# EAGLE design FAT_main_board (EAGLE 6.1)
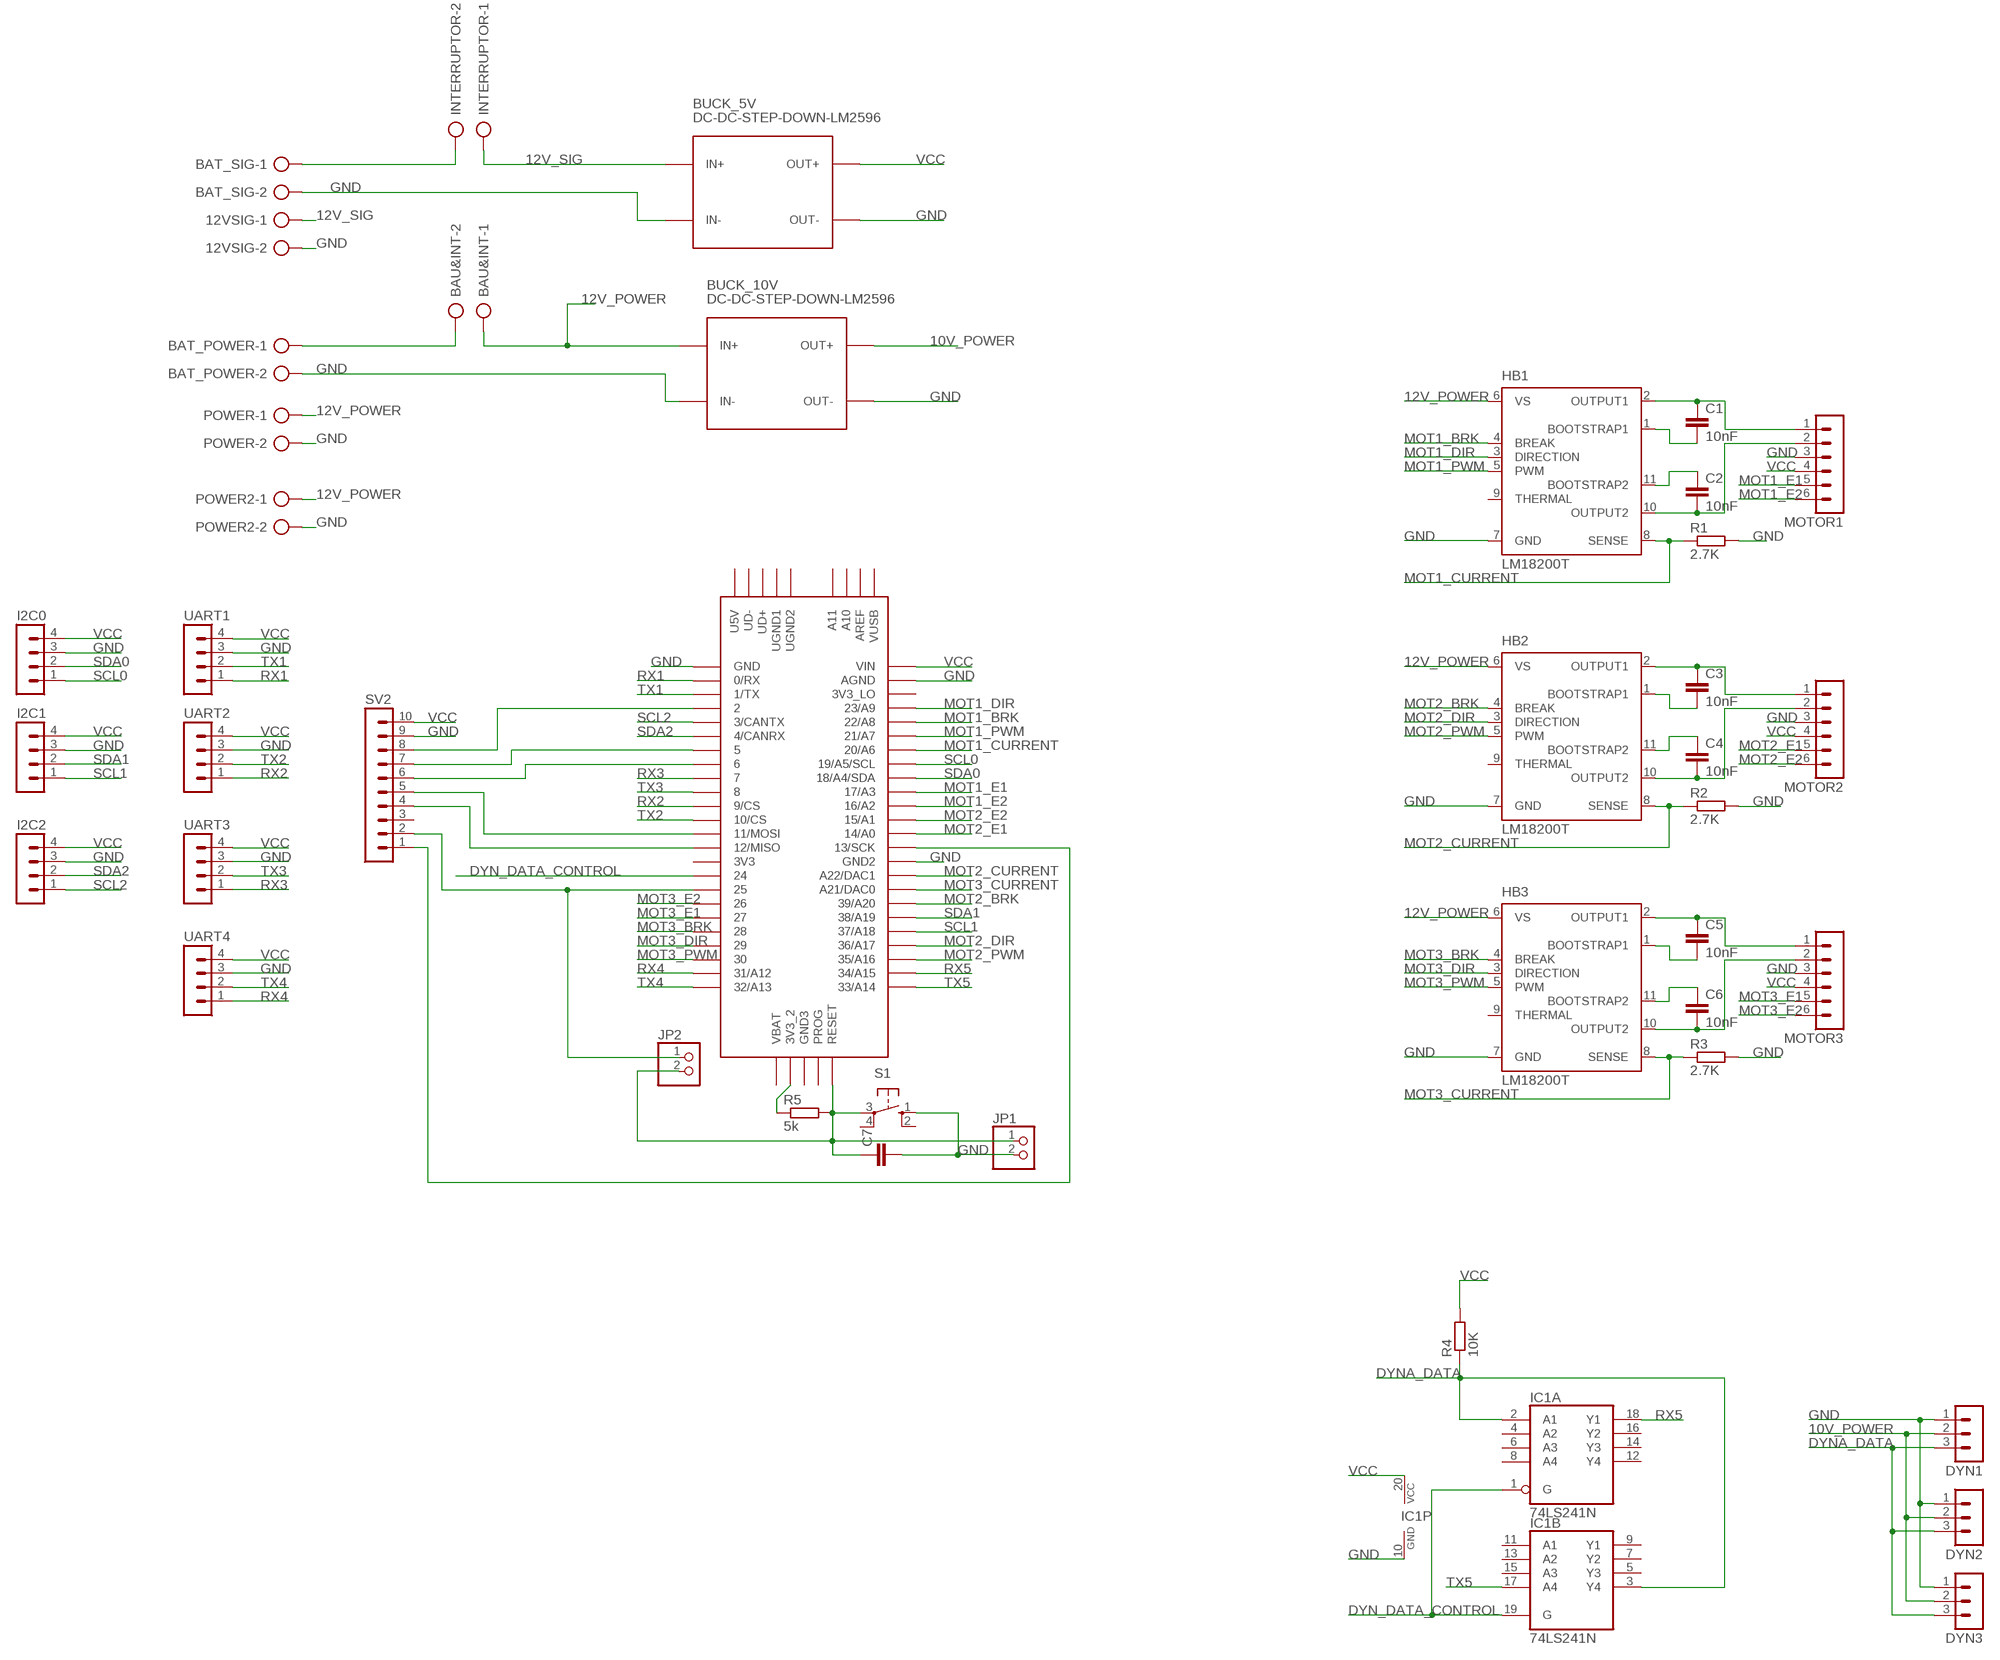
[diagram p0: schematic, sheet 1]

## Parts
12VSIG  AK300/2  [AK300/2]
BAT_POWER  AK300/2  [AK300/2]
BAT_SIG  AK300/2  [AK300/2]
BAU&INT  AK300/2  [AK300/2]
BUCK_5V  DC-DC-STEP-DOWN-LM2596  [DC-DC-STEP-DOWN-LM2596]
BUCK_10V  DC-DC-STEP-DOWN-LM2596  [DC-DC-STEP-DOWN-LM2596]
C1  10nF  C-EU050-035X075  [C050-035X075]
C2  10nF  C-EU050-035X075  [C050-035X075]
C3  10nF  C-EU050-035X075  [C050-035X075]
C4  10nF  C-EU050-035X075  [C050-035X075]
C5  10nF  C-EU050-035X075  [C050-035X075]
C6  10nF  C-EU050-035X075  [C050-035X075]
C7  C-EU025-025X050  [C025-025X050]
DYN1  MA03-1  [MA03-1]
DYN2  MA03-1  [MA03-1]
DYN3  MA03-1  [MA03-1]
HB1  LM18200T  [TO-220-11]
HB2  LM18200T  [TO-220-11]
HB3  LM18200T  [TO-220-11]
I2C0  MA04-1  [MA04-1]
I2C1  MA04-1  [MA04-1]
I2C2  MA04-1  [MA04-1]
IC1  74LS241N  [DIL20]
INTERRUPTOR  AK300/2  [AK300/2]
JP1  PINHD-1X2  [1X02]
JP2  PINHD-1X2  [1X02]
MOTOR1  MA06-1  [MA06-1]
MOTOR2  MA06-1  [MA06-1]
MOTOR3  MA06-1  [MA06-1]
POWER  AK300/2  [AK300/2]
POWER2  AK300/2  [AK300/2]
R1  2.7K  R-EU_0204/7  [0204/7]
R2  2.7K  R-EU_0204/7  [0204/7]
R3  2.7K  R-EU_0204/7  [0204/7]
R4  10K  R-EU_0204/7  [0204/7]
R5  5k  R-EU_0204/7  [0204/7]
S1  10-XX  [B3F-10XX]
SV2  MA10-1  [MA10-1]
U$1  TEENSY_3.5/3.6  [TEENSY_3.5/3.6]
UART1  MA04-1  [MA04-1]
UART2  MA04-1  [MA04-1]
UART3  MA04-1  [MA04-1]
UART4  MA04-1  [MA04-1]

## Nets
10V_POWER: BUCK_10V.OUT+ DYN1.2 DYN2.2 DYN3.2
12V_POWER: BAU&INT.1 BUCK_10V.IN+ HB1.6(VS) HB2.6(VS) HB3.6(VS) POWER2.1 POWER.1
12V_SIG: 12VSIG.1 BUCK_5V.IN+ INTERRUPTOR.1
DYN_DATA_CONTROL: IC1.1(A:G) IC1.19(B:G) U$1.24
DYNA_DATA: DYN1.3 DYN2.3 DYN3.3 IC1.2(A:A1) IC1.3(B:Y4) R4.1
GND: 12VSIG.2 BAT_POWER.2 BAT_SIG.2 BUCK_5V.IN- BUCK_5V.OUT- BUCK_10V.IN- BUCK_10V.OUT- C7.2 DYN1.1 DYN2.1 DYN3.1 HB1.7(GND) HB2.7(GND) HB3.7(GND) I2C0.3 I2C1.3 I2C2.3 IC1.10(P:GND) JP1.2 MOTOR1.3 MOTOR2.3 MOTOR3.3 POWER2.2 POWER.2 R1.2 R2.2 R3.2 S1.1(S) SV2.9 U$1.AGND U$1.GND U$1.GND2 UART1.3 UART2.3 UART3.3 UART4.3
MOT1_BRK: HB1.4(BREAK) U$1.22/A8
MOT1_CURRENT: HB1.8(SENSE) R1.1 U$1.20/A6
MOT1_DIR: HB1.3(DIRECTION) U$1.23/A9
MOT1_E1: MOTOR1.5 U$1.17/A3
MOT1_E2: MOTOR1.6 U$1.16/A2
MOT1_PWM: HB1.5(PWM) U$1.21/A7
MOT2_BRK: HB2.4(BREAK) U$1.39/A20
MOT2_CURRENT: HB2.8(SENSE) R2.1 U$1.A22/DAC1
MOT2_DIR: HB2.3(DIRECTION) U$1.36/A17
MOT2_E1: MOTOR2.5 U$1.14/A0
MOT2_E2: MOTOR2.6 U$1.15/A1
MOT2_PWM: HB2.5(PWM) U$1.35/A16
MOT3_BRK: HB3.4(BREAK) U$1.28
MOT3_CURRENT: HB3.8(SENSE) R3.1 U$1.21/DAC0(A21/DAC0)
MOT3_DIR: HB3.3(DIRECTION) U$1.29
MOT3_E1: MOTOR3.5 U$1.27
MOT3_E2: MOTOR3.6 U$1.26
MOT3_PWM: HB3.5(PWM) U$1.30
N$1: C1.1 HB1.2(OUTPUT1) MOTOR1.1
N$2: C2.2 HB1.10(OUTPUT2) MOTOR1.2
N$3: C1.2 HB1.1(BOOTSTRAP1)
N$4: C2.1 HB1.11(BOOTSTRAP2)
N$5: C3.1 HB2.2(OUTPUT1) MOTOR2.1
N$6: C3.2 HB2.1(BOOTSTRAP1)
N$7: C4.1 HB2.11(BOOTSTRAP2)
N$8: C4.2 HB2.10(OUTPUT2) MOTOR2.2
N$9: SV2.7 U$1.5
N$10: SV2.6 U$1.6
N$11: SV2.5 U$1.11/MOSI
N$12: SV2.4 U$1.12/MISO
N$13: BAT_POWER.1 BAU&INT.2
N$14: C5.1 HB3.2(OUTPUT1) MOTOR3.1
N$15: C5.2 HB3.1(BOOTSTRAP1)
N$16: C6.1 HB3.11(BOOTSTRAP2)
N$17: C6.2 HB3.10(OUTPUT2) MOTOR3.2
N$18: SV2.8 U$1.2
N$19: C7.1 JP1.1 JP2.2 R5.2 S1.3(P) U$1.RESET
N$20: BAT_SIG.1 INTERRUPTOR.2
N$24: SV2.1 U$1.13/SCK
N$26: R5.1 U$1.3V3_2
N$40: JP2.1 SV2.2 U$1.25
RX1: U$1.0/RX UART1.1
RX2: U$1.9/CS UART2.1
RX3: U$1.7 UART3.1
RX4: U$1.31/A12 UART4.1
RX5: IC1.18(A:Y1) U$1.34/A15
SCL0: I2C0.1 U$1.19/A5/SCL
SCL1: I2C1.1 U$1.37/A18
SCL2: I2C2.1 U$1.3/CANTX
SDA0: I2C0.2 U$1.18/A4/SDA
SDA1: I2C1.2 U$1.38/A19
SDA2: I2C2.2 U$1.4/CANRX
TX1: U$1.1/TX UART1.2
TX2: U$1.10/CS UART2.2
TX3: U$1.8 UART3.2
TX4: U$1.32/A13 UART4.2
TX5: IC1.17(B:A4) U$1.33/A14
VCC: BUCK_5V.OUT+ I2C0.4 I2C1.4 I2C2.4 IC1.20(P:VCC) MOTOR1.4 MOTOR2.4 MOTOR3.4 R4.2 SV2.10 U$1.VIN UART1.4 UART2.4 UART3.4 UART4.4
Unconnected: HB1.9(THERMAL) HB2.9(THERMAL) HB3.9(THERMAL) IC1.4(A:A2) IC1.5(B:Y3) IC1.6(A:A3) IC1.7(B:Y2) IC1.8(A:A4) IC1.9(B:Y1) IC1.11(B:A1) IC1.12(A:Y4) IC1.13(B:A2) IC1.14(A:Y3) IC1.15(B:A3) IC1.16(A:Y2) S1.2(S1) S1.4(P1) SV2.3 U$1.3V3 U$1.3V3_LO U$1.A10 U$1.A11 U$1.AREF U$1.GND3 U$1.PROG U$1.U5V U$1.UD+ U$1.UD- U$1.UGND1 U$1.UGND2 U$1.VBAT U$1.VUSB

## Library data of the parts
12VSIG BAT_POWER BAT_SIG BAU&INT INTERRUPTOR POWER POWER2 = con-ptr500:AK300/2: CONNECTOR; OC_FARNELL: unknown; OC_NEWARK: unknown
BUCK_5V BUCK_10V = diy-modules:DC-DC-STEP-DOWN-LM2596: DC/DC Step-Down Regulator based on LM2596-ADJ chip LM2596 datasheet available here: http://www.ti.com/lit/ds/symlink/lm2596.pdf Click here to find device on ebay.com <http://www.ebay.com/sch/lm2596+power+regulator>
C1-C6 = resistor:C-EU: CAPACITOR, European symbol
C7 = rcl:C-EU: CAPACITOR, European symbol
DYN1-DYN3 = con-lstb:MA03-1: PIN HEADER; OC_FARNELL: unknown; OC_NEWARK: unknown
HB1-HB3 = national-semiconductor:LM18200T: 3A, 55V H-Bridge Motor Control SourcE: http://cache.national.com/ds/LM/LMD18200.pdf; OC_FARNELL: unknown; OC_NEWARK: unknown
I2C0 I2C1 I2C2 UART1-UART4 = con-lstb:MA04-1: PIN HEADER; OC_FARNELL: unknown; OC_NEWARK: unknown
IC1 = 74xx-eu:74*241: Octal BUFFER and LINE DRIVER, 3-state
JP1 JP2 = pinhead:PINHD-1X2: PIN HEADER
MOTOR1-MOTOR3 = con-lstb:MA06-1: PIN HEADER; OC_FARNELL: unknown; OC_NEWARK: unknown
R1-R4 = resistor:R-EU_: RESISTOR, European symbol
R5 = rcl:R-EU_: RESISTOR, European symbol
S1 = switch-omron:10-XX: OMRON SWITCH; MPN: B3F-1000; OC_FARNELL: 176432; OC_NEWARK: 36M3542
SV2 = con-lstb:MA10-1: PIN HEADER; OC_FARNELL: unknown; OC_NEWARK: unknown
U$1 = Teensy356:TEENSY_3.5/3.6

## Board
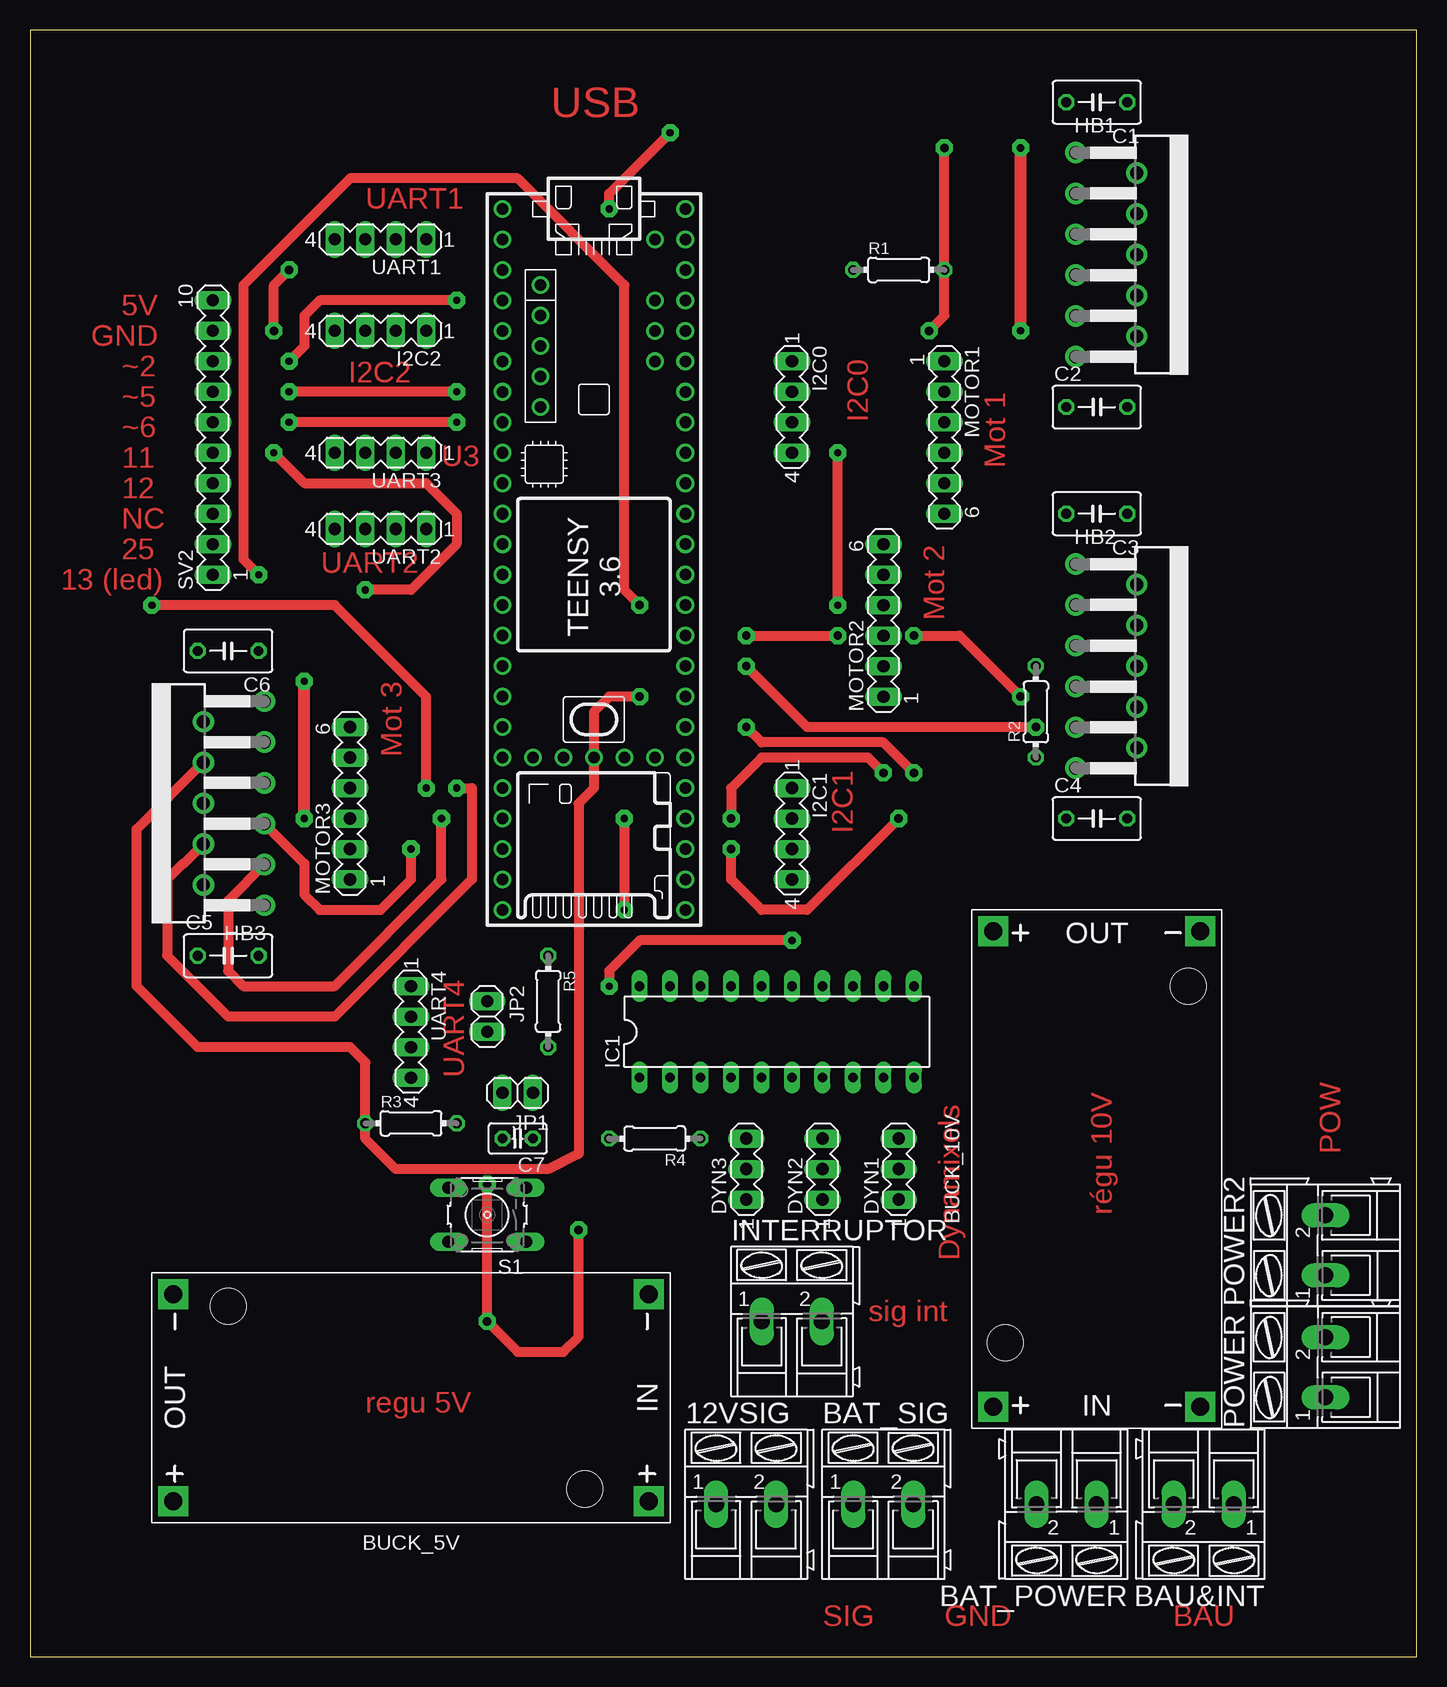
[diagram p1: board, top side]
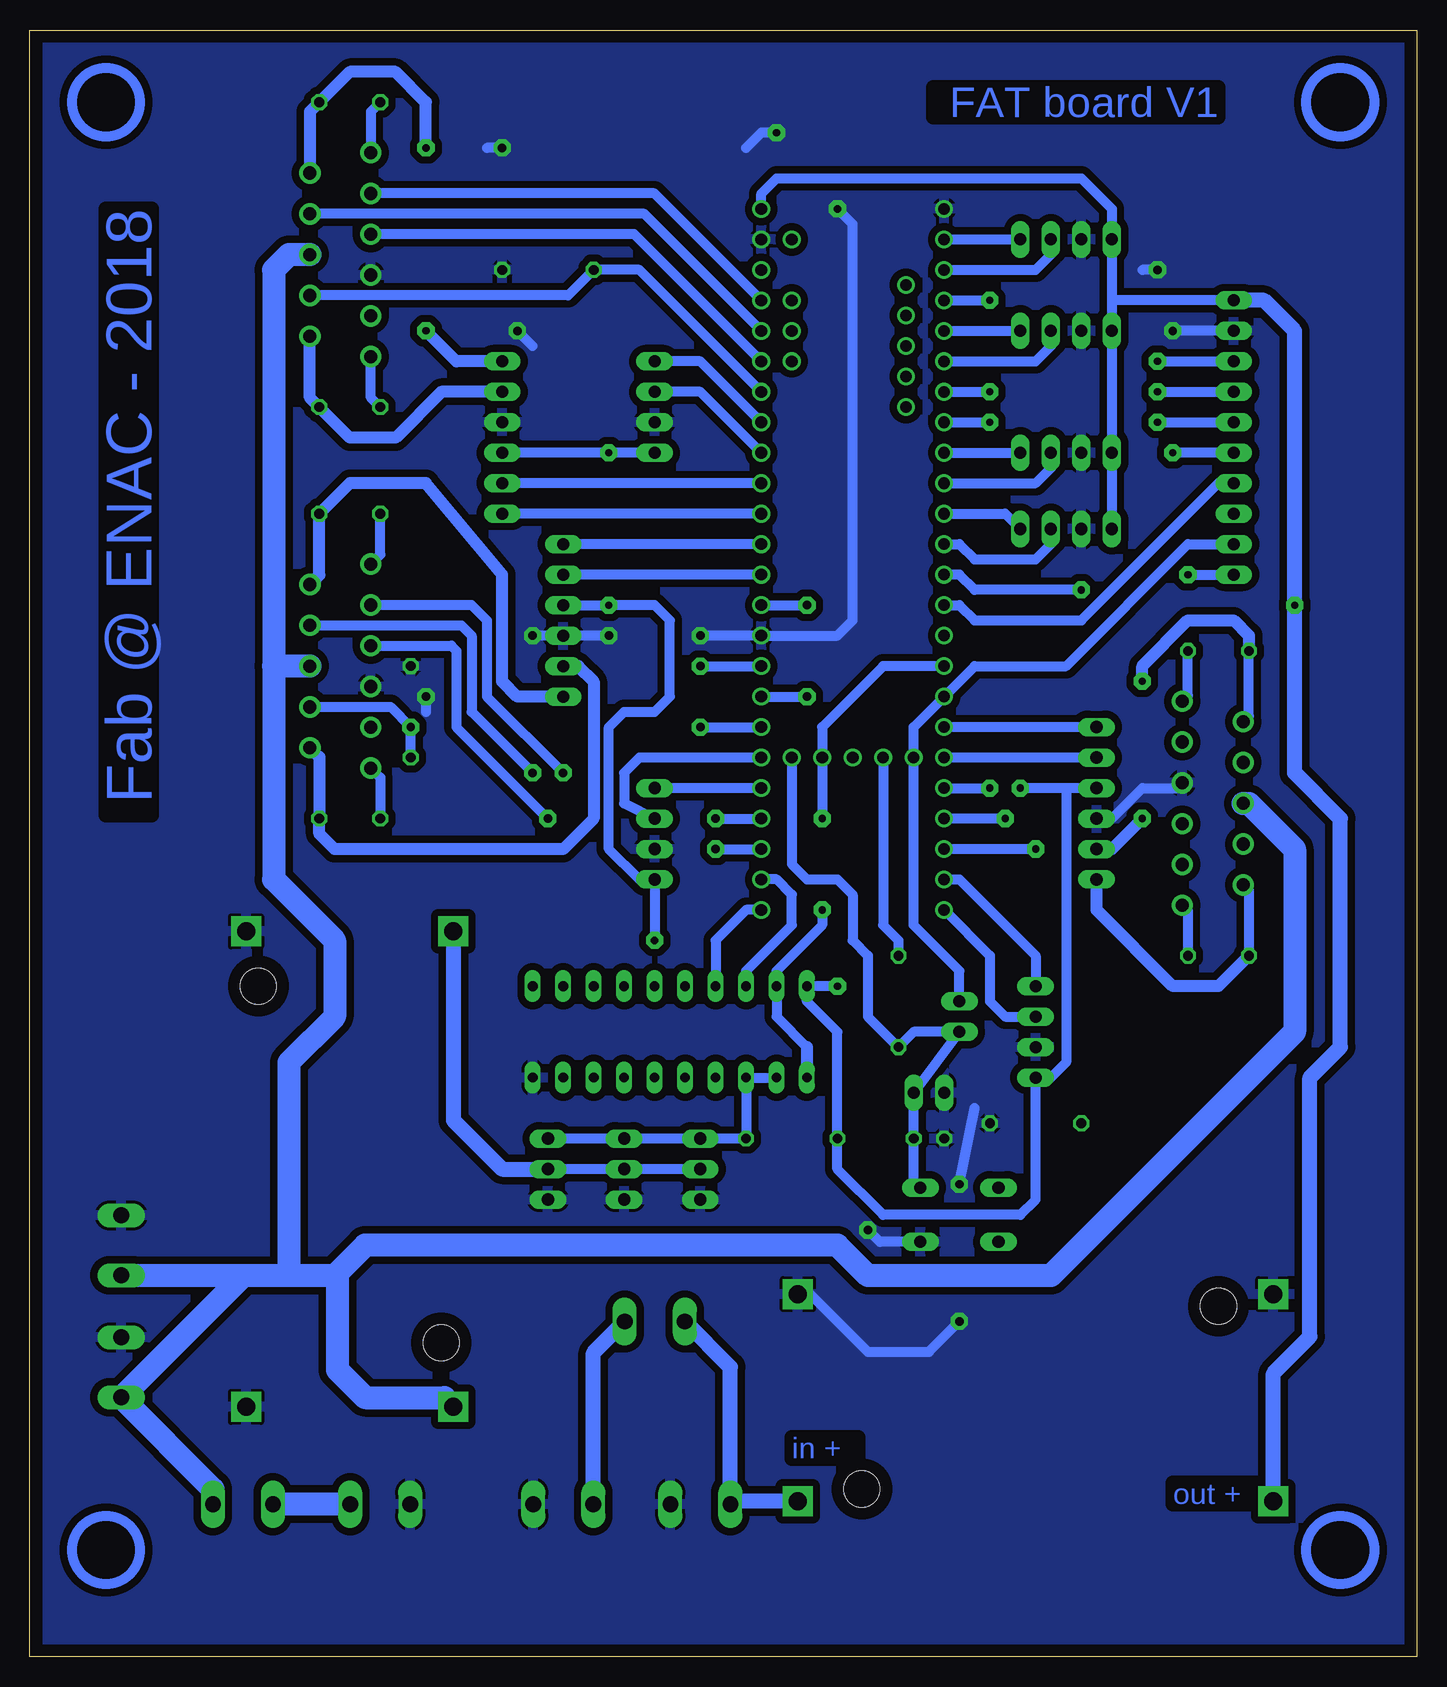
[diagram p2: board, bottom side, seen from below]

Size 115.55 x 135.56 mm. Coordinates in mm from the lower left corner, seen from the top.
Outline: 0,0 115.55,0 115.55,135.56 0,135.56 0,0
Copper layers (1*16): Top 0.035mm / dielectric 1.5mm / Bottom 0.035mm
Design rules: minimum track width 24mil, minimum drill 24mil, track to track 24mil, track to pad 16mil, pad to pad 16mil, via to via 16mil, smd to smd 8mil, copper to edge 40mil, drill to drill 8mil, minimum pad ring 10mil, minimum via ring 8mil, stop-mask expansion 4mil, vias tented up to drill 0mil, thermal gap 10mil

### Footprints (pad centres in the part's own frame; a part is rotated, then mirrored left to right if it is on the bottom)
AK300/2 = drill 1.321 long: 1 -2.515,0; 2 2.489,0
DC-DC-STEP-DOWN-LM2596 = drill 1.5 pad 2.5 square: IN+ -19.812,8.636; IN- -19.812,-8.636; OUT+ 19.812,8.636; OUT- 19.812,-8.636 | hole 3: -14.478,7.62; 15.24,-7.62
C050-035X075 = drill 0.813 octagon: 1 -2.54,0; 2 2.54,0
C025-025X050 = drill 0.813 octagon: 1 -1.27,0; 2 1.27,0
MA03-1 = drill 1.016 long: 1 -2.54,0; 2 0,0; 3 2.54,0
TO-220-11 = drill 1.1 pad 1.778: 1 -8.5,-9.37; 2 -6.8,-4.29; 3 -5.1,-9.37; 4 -3.4,-4.29; 5 -1.7,-9.37; 6 0,-4.29; 7 1.7,-9.37; 8 3.4,-4.29; 9 5.1,-9.37; 10 6.8,-4.29; 11 8.5,-9.37
MA04-1 = drill 1.016 long: 1 -3.81,0; 2 -1.27,0; 3 1.27,0; 4 3.81,0
DIL20 = drill 0.813 long: 1 -11.43,-3.81; 2 -8.89,-3.81; 3 -6.35,-3.81; 4 -3.81,-3.81; 5 -1.27,-3.81; 6 1.27,-3.81; 7 3.81,-3.81; 8 6.35,-3.81; 9 8.89,-3.81; 10 11.43,-3.81; 11 11.43,3.81; 12 8.89,3.81; 13 6.35,3.81; 14 3.81,3.81; 15 1.27,3.81; 16 -1.27,3.81; 17 -3.81,3.81; 18 -6.35,3.81; 19 -8.89,3.81; 20 -11.43,3.81
1X02 = drill 1.016 long: 1 -1.27,0; 2 1.27,0
MA06-1 = drill 1.016 long: 1 -6.35,0; 2 -3.81,0; 3 -1.27,0; 4 1.27,0; 5 3.81,0; 6 6.35,0
0204/7 = drill 0.813 octagon: 1 -3.81,0; 2 3.81,0
B3F-10XX = drill 1.016 long: 1 -3.251,2.261; 2 3.251,2.261; 3 -3.251,-2.261; 4 3.251,-2.261
MA10-1 = drill 1.016 long: 1 -11.43,0; 2 -8.89,0; 3 -6.35,0; 4 -3.81,0; 5 -1.27,0; 6 1.27,0; 7 3.81,0; 8 6.35,0; 9 8.89,0; 10 11.43,0
TEENSY_3.5/3.6 = drill 0.965: 0/RX -25.4,-7.62; 1/TX -22.86,-7.62; 2 -20.32,-7.62; 3/CANTX -17.78,-7.62; 3V3 7.62,-7.62; 3V3_2 17.78,-2.54; 3V3_LO -22.86,7.62; 4/CANRX -15.24,-7.62; 5 -12.7,-7.62; 6 -10.16,-7.62; 7 -7.62,-7.62; 8 -5.08,-7.62; 9/CS -2.54,-7.62; 10/CS 0,-7.62; 11/MOSI 2.54,-7.62; 12/MISO 5.08,-7.62; 13/SCK 5.08,7.62; 14/A0 2.54,7.62; 15/A1 0,7.62; 16/A2 -2.54,7.62; 17/A3 -5.08,7.62; 18/A4/SDA -7.62,7.62; 19/A5/SCL -10.16,7.62; 20/A6 -12.7,7.62; 21/A7 -15.24,7.62; 21/DAC0 12.7,7.62; 22/A8 -17.78,7.62; 23/A9 -20.32,7.62; 24 10.16,-7.62; 25 12.7,-7.62; 26 15.24,-7.62; 27 17.78,-7.62; 28 20.32,-7.62; 29 22.86,-7.62; 30 25.4,-7.62; 31/A12 27.94,-7.62; 32/A13 30.48,-7.62; 33/A14 30.48,7.62; 34/A15 27.94,7.62; 35/A16 25.4,7.62; 36/A17 22.86,7.62; 37/A18 20.32,7.62; 38/A19 17.78,7.62; 39/A20 15.24,7.62; A10 -17.78,5.08; A11 -15.24,5.08; A22/DAC1 10.16,7.62; AGND -25.4,7.62; AREF -20.32,5.08; GND -27.94,-7.62; GND2 7.62,7.62; GND3 17.78,0; PROG 17.78,2.54; RESET 17.78,5.08; U5V -21.59,-4.445; UD+ -16.51,-4.445; UD- -19.05,-4.445; UGND1 -13.97,-4.445; UGND2 -11.43,-4.445; VBAT 17.78,-5.08; VIN -27.94,7.62; VUSB -25.4,5.08

### Placement (x,y rotation side)
12VSIG  59.69,12.7 0 top
BAT_POWER  86.36,12.7 180 top
BAT_SIG  71.12,12.7 0 top
BAU&INT  97.79,12.7 180 top
BUCK_5V  31.75,21.59 180 top
BUCK_10V  88.9,40.64 90 top
C1  88.9,129.54 180 top
C2  88.9,104.14 0 top
C3  88.9,95.25 180 top
C4  88.9,69.85 0 top
C5  16.51,58.42 0 top
C6  16.51,83.82 180 top
C7  40.64,43.18 180 top
DYN1  72.39,40.64 90 top
DYN2  66.04,40.64 90 top
DYN3  59.69,40.64 90 top
HB1  96.52,116.84 270 top
HB2  96.52,82.55 270 top
HB3  10.16,71.12 90 top
I2C0  63.5,104.14 270 top
I2C1  63.5,68.58 270 top
I2C2  29.21,110.49 180 top
IC1  62.23,52.07 0 top
INTERRUPTOR  63.5,27.94 0 top
JP1  40.64,46.99 180 top
JP2  38.1,53.34 270 top
MOTOR1  76.2,101.6 270 top
MOTOR2  71.12,86.36 90 top
MOTOR3  26.67,71.12 90 top
POWER  107.95,24.13 90 top
POWER2  107.95,34.29 90 top
R1  72.39,115.57 0 top
R2  83.82,78.74 90 top
R3  31.75,44.45 0 top
R4  52.07,43.18 180 top
R5  43.18,54.61 270 top
S1  38.1,36.83 180 top
SV2  15.24,101.6 90 top
U$1  46.99,92.71 270 top
UART1  29.21,118.11 180 top
UART2  29.21,93.98 180 top
UART3  29.21,100.33 180 top
UART4  31.75,52.07 270 top

### Tracks (layer width: path | path; a pad name or v marks a point on that pad's centre or on a via)
10V_POWER
  Bottom 0.813: DYN3.2 DYN2.2 DYN1.2
  Bottom 1.27: BUCK_10V.OUT+ 80.26,44.7 76.2,40.64 DYN1.2
12V_POWER
  Bottom 0.61: 107.95,21.59 POWER.1 | 90.17,31.75 89.94,31.75
  Bottom 1.27: POWER2.1 93.98,31.77 89.94,31.77
  Bottom 1.93: BAU&INT.1 100.31,13.97 POWER.1 | POWER2.1 102.9,31.77 102.87,31.75 | HB2.6 95.25,82.55 | 95.25,82.55 95.25,64.77 90.17,59.69 90.17,53.34 93.98,49.53 93.98,31.77 | HB1.6 93.98,116.84 95.25,115.57 95.25,82.55 | HB3.6 13.97,71.12 10.16,67.31 10.16,52.07 30.48,31.75 45.72,31.75 48.26,34.29 87.63,34.29 90.17,31.75 97.79,31.75 | 97.79,31.75 107.95,31.75 | 89.94,31.77 89.94,31.75 89.94,23.9 87.63,21.59 81.03,21.59 BUCK_10V.IN+ | 97.79,31.75 107.95,21.59
12V_SIG
  Bottom 1.27: BUCK_5V.IN+ 56.92,12.95 12VSIG.1 57.17,24.13 INTERRUPTOR.1
DYN_DATA_CONTROL  (via drill 0.6 pad 1.42)
  Top 0.813: v49.53,69.85 v49.53,62.23
  Bottom 0.813: 50.8,50.8 53.34,53.34 IC1.19 53.34,57.15 49.53,60.96 v49.53,62.23 | U$1.24 44.45,82.55 49.53,77.47 v49.53,69.85
  Bottom 1.016: 50.8,50.8 IC1.1
DYNA_DATA
  Bottom 0.813: IC1.2 IC1.3 R4.1 DYN3.3 DYN2.3 DYN1.3
GND  (via drill 0.6 pad 1.42, 0.7 pad 1.42)
  Top 0.813: v73.66,85.09 77.47,85.09 v82.55,80.01 | v48.26,120.65 48.26,121.92 v53.34,127 | v38.1,39.37 v38.1,27.94 40.64,25.4 44.45,25.4 45.72,26.67 v45.72,35.56 | v74.93,110.49 76.2,111.76 R1.2 v76.2,125.73 | v59.69,85.09 v67.31,85.09 | v20.32,110.49 20.32,114.3 v21.59,115.57
  Bottom 0.61: SV2.9 | 16.51,110.49 SV2.9
  Bottom 0.813: v73.66,85.09 MOTOR2.3 v67.31,85.09 | v82.55,80.01 82.55,78.74 | v48.26,120.65 46.99,119.38 46.99,86.36 48.26,85.09 U$1.GND2 v59.69,85.09 | v53.34,127 54.61,127 55.88,125.73 | BUCK_5V.IN- 50.55,30.23 45.72,25.4 40.64,25.4 v38.1,27.94 | v38.1,39.37 36.83,45.72 | MOTOR3.3 25.4,69.85 22.86,72.39 19.96,72.39 HB3.7 | S1.1 44.73,34.57 v45.72,35.56 | v74.93,110.49 73.66,109.22 | v76.2,125.73 77.47,125.73 | 16.51,110.49 v20.32,110.49 | v21.59,115.57 22.86,115.57
  pour Bottom: 1.27,1.27 1.27,134.62 114.3,134.62 114.3,1.27
MOT1_BRK
  Bottom 0.813: U$1.22/A8 64.36,120.24 HB1.4
MOT1_CURRENT
  Bottom 0.813: U$1.20/A6 64.77,115.57 R1.1 70.71,113.44 HB1.8
MOT1_DIR
  Bottom 0.813: U$1.23/A9 63.52,121.94 HB1.3
MOT1_E1
  Bottom 0.813: U$1.17/A3 MOTOR1.5
MOT1_E2
  Bottom 0.813: U$1.16/A2 MOTOR1.6
MOT1_PWM
  Bottom 0.813: U$1.21/A7 65.2,118.54 HB1.5
MOT2_BRK  (via drill 0.7 pad 1.42)
  Top 0.813: v73.66,73.66 71.12,76.2 60.96,76.2 v59.69,77.47
  Bottom 0.813: HB2.4 79.6,85.95 78.74,85.09 78.74,78.74 v73.66,73.66 | v59.69,77.47 U$1.39/A20
MOT2_CURRENT  (via drill 0.7 pad 1.42)
  Top 0.813: v83.82,77.47 64.77,77.47 v59.69,82.55
  Bottom 0.813: HB2.8 85.5,79.15 v83.82,77.47 R2.1 | v59.69,82.55 U$1.A22/DAC1
MOT2_DIR  (via drill 0.7 pad 1.42)
  Top 0.813: v71.12,73.66 69.85,74.93 60.96,74.93 58.42,72.39 v58.42,69.85
  Bottom 0.813: HB2.3 78.76,87.65 77.47,86.36 77.47,80.01 v71.12,73.66 | v58.42,69.85 U$1.36/A17
MOT2_E1
  Bottom 0.813: U$1.14/A0 MOTOR2.5
MOT2_E2
  Bottom 0.813: U$1.15/A1 MOTOR2.6
MOT2_PWM  (via drill 0.7 pad 1.42)
  Top 0.813: v72.39,69.85 64.77,62.23 60.96,62.23 58.42,64.77 v58.42,67.31
  Bottom 0.813: HB2.5 80.44,84.25 80.01,83.82 80.01,77.47 v72.39,69.85 | v58.42,67.31 U$1.35/A16
MOT3_BRK  (via drill 0.6 pad 1.42)
  Top 0.813: v35.56,72.39 36.83,72.39 36.83,64.77 25.4,53.34 16.51,53.34 11.43,58.42 11.43,64.77 12.7,66.04 12.77,66.04 HB3.4
  Bottom 0.813: U$1.28 v35.56,72.39
MOT3_CURRENT  (via drill 0.7 pad 1.42)
  Top 0.813: v50.8,80.01 48.26,80.01 46.99,78.74 46.99,72.39 45.72,71.12 45.72,41.91 43.18,40.64 30.48,40.64 27.94,43.18 R3.1 27.94,49.53 26.67,50.8 13.97,50.8 8.89,55.88 8.89,68.96 HB3.8
  Bottom 0.813: U$1.21/DAC0 v50.8,80.01
MOT3_DIR  (via drill 0.6 pad 1.42)
  Top 0.813: HB3.3 16.51,63 16.51,57.15 17.78,55.88 25.4,55.88 34.29,64.77 v34.29,69.85
  Bottom 0.813: v34.29,69.85 U$1.29
MOT3_E1
  Bottom 0.813: MOTOR3.5 U$1.27
MOT3_E2
  Bottom 0.813: MOTOR3.6 U$1.26
MOT3_PWM  (via drill 0.6 pad 1.42)
  Top 0.813: v31.75,67.31 31.75,64.77 29.21,62.23 24.13,62.23 22.86,63.5 22.86,66.09 HB3.5
  Bottom 0.813: v31.75,67.31 U$1.30
N$1  (via drill 0.6 pad 1.42)
  Top 1.016: v82.55,110.49 v82.55,125.73
  Bottom 1.016: HB1.2 92.23,128.75 C1.1 88.9,132.08 85.09,132.08 82.55,129.54 v82.55,125.73 | MOTOR1.1 80.01,107.95 v82.55,110.49
N$2
  Bottom 1.016: HB1.10 92.23,104.93 C2.2 88.9,101.6 85.09,101.6 81.28,105.41 MOTOR1.2
N$3
  Bottom 0.813: C1.2 87.15,128.75 HB1.1
N$4
  Bottom 0.813: C2.1 87.15,104.93 HB1.11
N$5
  Bottom 1.016: HB2.2 91.44,90.14 C3.1 88.9,97.79 82.55,97.79 76.2,90.17 76.2,81.28 74.93,80.01 MOTOR2.1
N$6
  Bottom 0.813: HB2.1 86.36,91.84 C3.2
N$7
  Bottom 0.813: HB2.11 86.36,73.26 C4.1
N$8
  Bottom 1.016: HB2.10 91.44,74.96 C4.2 91.44,68.58 90.17,67.31 71.12,67.31 68.58,69.85 68.58,81.28 69.85,82.55 MOTOR2.2
N$9  (via drill 0.6 pad 1.42)
  Top 0.813: v35.56,105.41 v21.59,105.41
  Bottom 0.813: U$1.5 v35.56,105.41 | v21.59,105.41 SV2.7
N$10  (via drill 0.6 pad 1.42)
  Top 0.813: v35.56,102.87 v21.59,102.87
  Bottom 0.813: U$1.6 v35.56,102.87 | v21.59,102.87 SV2.6
N$11  (via drill 0.6 pad 1.42)
  Top 0.813: v20.32,100.33 22.86,97.79 33.02,97.79 35.56,95.25 35.56,92.71 31.75,88.9 v27.94,88.9
  Bottom 0.813: SV2.5 v20.32,100.33 | v27.94,88.9 36.83,88.9 38.1,90.17 U$1.11/MOSI
N$12
  Bottom 0.813: SV2.4 16.51,97.79 27.94,86.36 36.83,86.36 38.1,87.63 U$1.12/MISO
N$13
  Bottom 1.93: BAT_POWER.1 BAU&INT.2
N$14
  Bottom 0.813: HB3.2 13.97,63.84 C5.1
  Bottom 1.016: C5.1 16.51,55.88 20.32,55.88 26.67,62.23 MOTOR3.1
N$15
  Bottom 0.813: HB3.1 19.05,62.14 C5.2
N$16
  Bottom 0.813: HB3.11 19.05,80.1 C6.1
N$17  (via drill 0.6 pad 1.42)
  Top 1.016: v22.86,69.85 v22.86,81.28
  Bottom 0.813: HB3.10 13.97,78.4 C6.2
  Bottom 1.016: MOTOR3.2 25.4,67.31 v22.86,69.85 | C6.2 13.97,85.09 15.24,86.36 19.05,86.36 22.86,82.55 v22.86,81.28
N$18  (via drill 0.6 pad 1.42)
  Top 0.813: v35.56,113.03 24.13,113.03 22.86,111.76 22.86,109.22 v21.59,107.95
  Bottom 0.813: U$1.2 v35.56,113.03 | v21.59,107.95 SV2.8
N$19
  Bottom 0.813: U$1.RESET 52.07,66.04 50.8,64.77 48.26,64.77 46.99,63.5 46.99,59.69 45.72,58.42 45.72,53.34 R5.2 41.91,52.07 JP2.2 JP1.1 C7.1 41.91,39.65 S1.3
N$20
  Bottom 1.27: BAT_SIG.1 68.61,25.32 INTERRUPTOR.2
N$24  (via drill 0.6 pad 1.42, 0.7 pad 1.42)
  Top 0.813: v50.8,87.63 49.53,88.9 49.53,114.3 40.64,123.19 26.67,123.19 17.78,114.3 17.78,91.44 v19.05,90.17
  Bottom 0.813: U$1.13/SCK v50.8,87.63 | v19.05,90.17 SV2.1
N$26
  Bottom 0.813: U$1.3V3_2 44.45,60.96 43.18,59.69 R5.1
N$40
  Bottom 0.813: JP2.1 38.1,57.15 41.91,60.96 41.91,77.47 U$1.25 36.83,82.55 29.21,82.55 19.05,92.71 SV2.2
RX1
  Bottom 0.813: U$1.0/RX UART1.1
RX2
  Bottom 0.813: U$1.9/CS 34.29,95.25 UART2.1
RX3
  Bottom 0.813: U$1.7 UART3.1
RX4
  Bottom 0.813: U$1.31/A12 38.1,64.77 31.75,58.42 UART4.1
RX5
  Bottom 0.813: IC1.18 55.88,57.15 52.07,60.96 52.07,63.5 53.34,64.77 U$1.34/A15
SCL0
  Bottom 0.813: U$1.19/A5/SCL 59.69,107.95 I2C0.1
SCL1
  Bottom 0.813: U$1.37/A18 I2C1.1
SCL2
  Bottom 0.813: U$1.3/CANTX I2C2.1
SDA0
  Bottom 0.813: U$1.18/A4/SDA 59.69,105.41 I2C0.2
SDA1
  Bottom 0.813: U$1.38/A19 64.77,74.93 66.04,73.66 66.04,71.12 I2C1.2
SDA2
  Bottom 0.813: U$1.4/CANRX 31.75,107.95 30.48,109.22 I2C2.2
TX1
  Bottom 0.813: U$1.1/TX 31.75,115.57 30.48,116.84 UART1.2
TX2
  Bottom 0.813: U$1.10/CS 38.1,92.71 36.83,91.44 31.75,91.44 30.48,92.71 UART2.2
TX3
  Bottom 0.813: U$1.8 31.75,97.79 30.48,99.06 UART3.2
TX4
  Bottom 0.813: U$1.32/A13 35.56,58.42 35.56,54.61 34.29,53.34 UART4.2
TX5
  Bottom 0.813: U$1.33/A14 55.88,62.23 58.42,59.69 IC1.17
VCC  (via drill 0.6 pad 1.42)
  Top 0.813: v67.31,87.63 v67.31,100.33 | v63.5,59.69 50.8,59.69 48.26,57.15 v48.26,55.88 | v33.02,72.39 33.02,80.01 25.4,87.63 v10.16,87.63
  Bottom 0.813: I2C0.4 v67.31,100.33 MOTOR1.4 | MOTOR2.4 v67.31,87.63 63.5,87.63 62.23,86.36 62.23,80.01 63.5,78.74 66.04,78.74 67.31,77.47 67.31,67.31 64.77,64.77 I2C1.4 v63.5,59.69 | v48.26,55.88 IC1.20 50.8,54.61 48.26,52.07 R4.2 48.26,40.64 44.45,36.83 33.02,36.83 31.75,38.1 UART4.4 30.48,48.26 29.21,49.53 29.21,72.39 | 25.4,113.03 UART1.4 25.4,120.65 27.94,123.19 53.34,123.19 54.61,121.92 U$1.VIN | 25.4,113.03 I2C2.4 UART3.4 UART2.4 | SV2.10 25.4,113.03 | MOTOR3.4 29.21,72.39 | 29.21,72.39 v33.02,72.39
  Bottom 1.27: BUCK_5V.OUT+ 11.94,23.62 8.89,26.67 8.89,48.26 6.35,50.8 6.35,69.85 10.16,73.66 v10.16,87.63 10.16,110.49 12.7,113.03 SV2.10
(copper drawn outside any net)
  shapes: Bottom circle x4

### Text on the board
Top: USB | UART1 | 5V | GND | I2C2 | ~2 | ~5 | I2C0 | ~6 | U3 | 11 | Mot 1 | 12 | NC | UART2 | 25 | 13 (led) | Mot 2 | Mot 3 | I2C1 | UART4 | POW | régu 10V | Dynamixels | sig int | regu 5V | SIG | GND | BAU
Bottom: FAT board V1 | Fab @ ENAC - 2018 | in + | out +